# Altium schematic sheet muon_v2.SchDoc
size A4; SheetNumber: 1; SheetTotal: 1
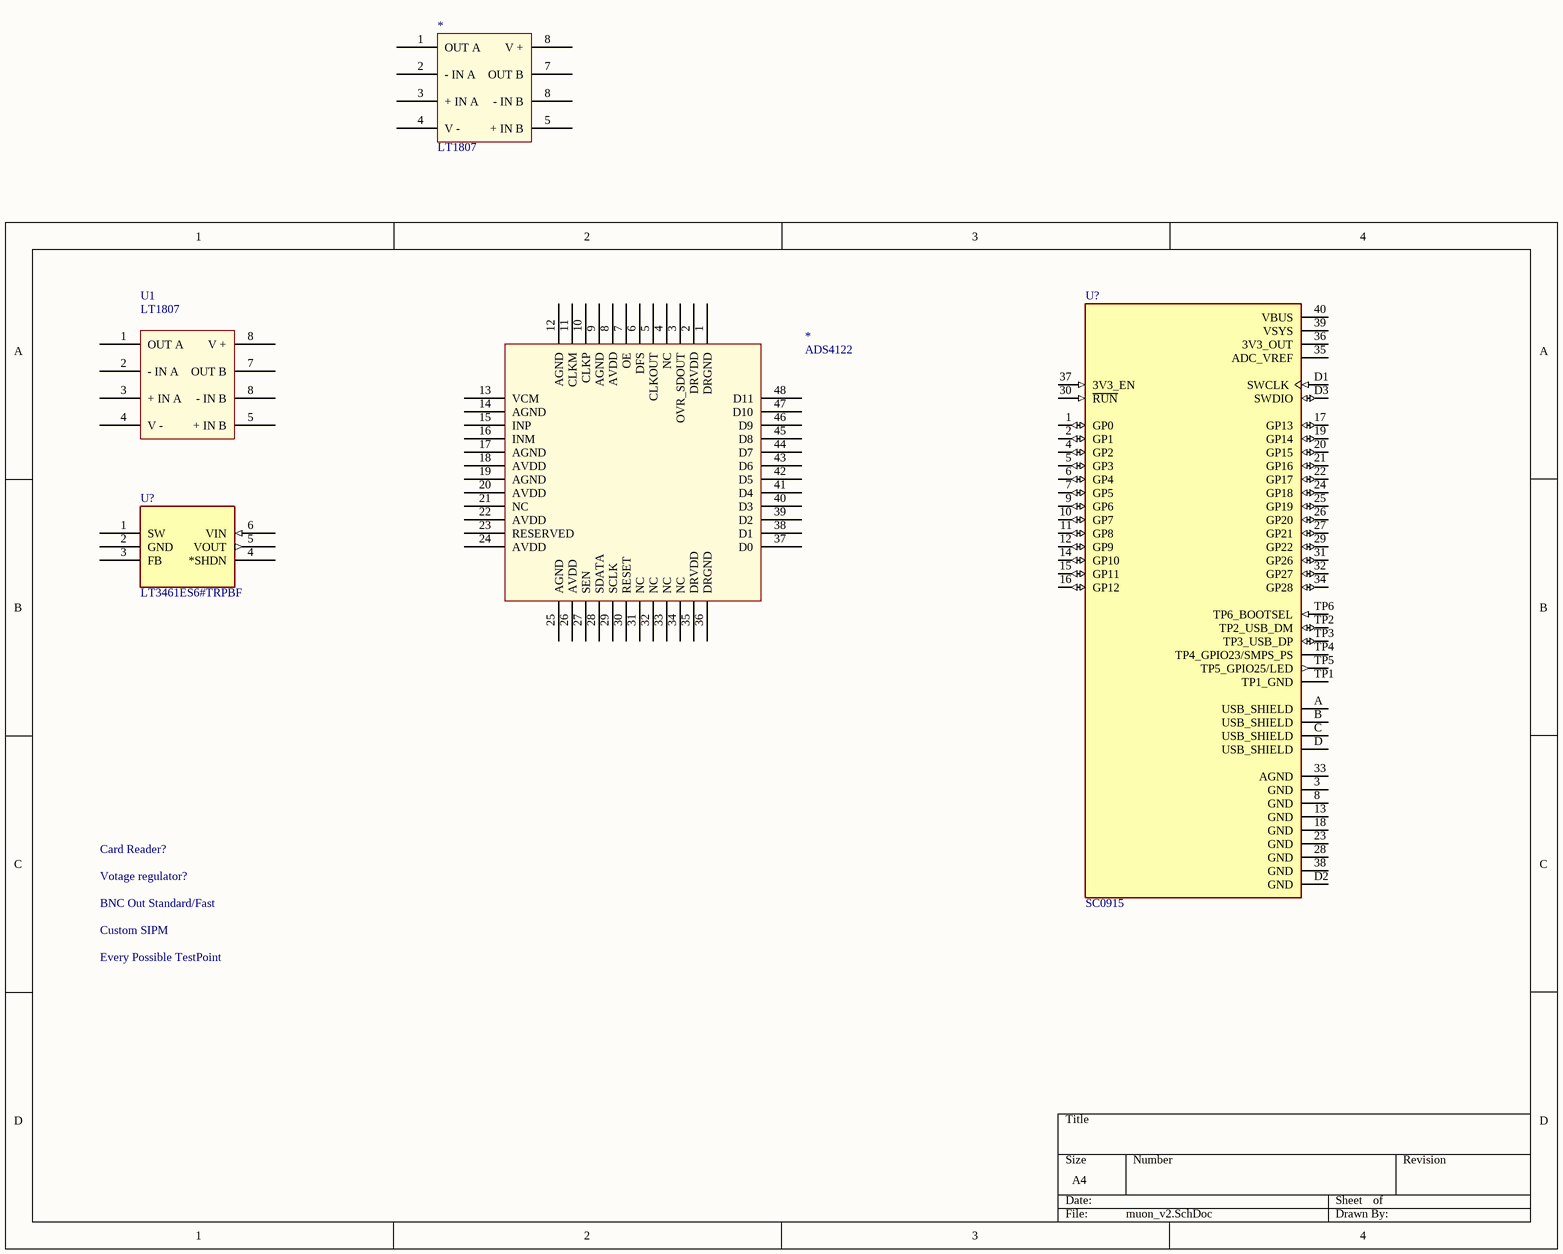
[diagram p0: muon_v2.SchDoc]

## Parts
(Parts that share a designator on the sheet are numbered #1, #2 ... from top to bottom, then left to right.)
*#1  ADS4122  [QFN50P700X700X100-49N]
*#2  LT1807  [SOIC-8]
U1  LT1807  [SOIC-8]
U?#1  LT3461ES6#TRPBF  [TSOT23-6]
U?#2  SC0915  [MODULE_SC0915]

## Nets

Not connected (* = marked no-connect by the designer): *#1 1(DRGND) 2(DRVDD) 3(OVR_SDOUT) 4(NC) 5(CLKOUT) 6(DFS) 7(OE) 8(AVDD) 9(AGND) 10(CLKP) 11(CLKM) 12(AGND) 13(VCM) 14(AGND) 15(INP) 16(INM) 17(AGND) 18(AVDD) 19(AGND) 20(AVDD) 21(NC) 22(AVDD) 23(RESERVED) 24(AVDD) 25(AGND) 26(AVDD) 27(SEN) 28(SDATA) 29(SCLK) 30(RESET) 31(NC) 32(NC) 33(NC) 34(NC) 35(DRVDD) 36(DRGND) 37(D0) 38(D1) 39(D2) 40(D3) 41(D4) 42(D5) 43(D6) 44(D7) 45(D8) 46(D9) 47(D10) 48(D11); *#2 1(OUT_A) 2(-_IN_A) 3(+_IN_A) 4(V_-) 5(+_IN_B) 7(OUT_B) 8(-_IN_B); U1 1(OUT_A) 2(-_IN_A) 3(+_IN_A) 4(V_-) 5(+_IN_B) 7(OUT_B) 8(-_IN_B); U?#1 1(SW) 2(GND) 3(FB) 4(*SHDN) 5(VOUT) 6(VIN); U?#2 1(GP0) 2(GP1) 3(GND) 4(GP2) 5(GP3) 6(GP4) 7(GP5) 8(GND) 9(GP6) 10(GP7) 11(GP8) 12(GP9) 13(GND) 14(GP10) 15(GP11) 16(GP12) 17(GP13) 18(GND) 19(GP14) 20(GP15) 21(GP16) 22(GP17) 23(GND) 24(GP18) 25(GP19) 26(GP20) 27(GP21) 28(GND) 29(GP22) 30(~{RUN}) 31(GP26) 32(GP27) 33(AGND) 34(GP28) 35(ADC_VREF) 36(3V3_OUT) 37(3V3_EN) 38(GND) 39(VSYS) 40(VBUS) A(USB_SHIELD) B(USB_SHIELD) C(USB_SHIELD) D(USB_SHIELD) D1(SWCLK) D2(GND) D3(SWDIO) TP1(TP1_GND) TP2(TP2_USB_DM) TP3(TP3_USB_DP) TP4(TP4_GPIO23/SMPS_PS) TP5(TP5_GPIO25/LED) TP6(TP6_BOOTSEL)

## Notes on the sheet
- Card Reader?
- Votage regulator?
- BNC Out Standard/Fast
- Custom SIPM
- Every Possible TestPoint

## Library data of the parts
U?#1 = LT3461ES6#TRPBF: 1.3MHz Step-Up DC/DC Converters with Integrated Schottky in ThinSOT; MF: Analog Devices; SnapEDA_Link: https://www.snapeda.com/parts/LT3461ES6%23TRPBF/Analog+Devices/view-part/?ref=snap; Availability: In Stock; MP: LT3461ES6#TRPBF; Price: None; Check_prices: https://www.snapeda.com/parts/LT3461ES6%23TRPBF/Analog+Devices/view-part/?ref=eda; Package: SOT-6 Analog Devices; Purchase-URL: https://pricing.snapeda.com/search/part/LT3461ES6#TRPBF/?ref=eda; Value: *
U?#2 = SC0915: RP2040 Raspberry Pi Pico series ARMÂ® CortexÂ®-M0+ MCU 32-Bit Embedded Evaluation Board; SnapEDA_Link: https://www.snapeda.com/parts/SC0915/Raspberry+Pi/view-part/?ref=snap; Availability: In Stock; Package: None; Price: None; MP: SC0915; Check_prices: https://www.snapeda.com/parts/SC0915/Raspberry+Pi/view-part/?ref=eda; MF: Raspberry Pi; Value: *; Purchase-URL: https://pricing.snapeda.com/search/part/SC0915/?ref=eda